# Altium schematic sheet AQCA-Light-Control-WarmWhite-A0.SchDoc
size A4
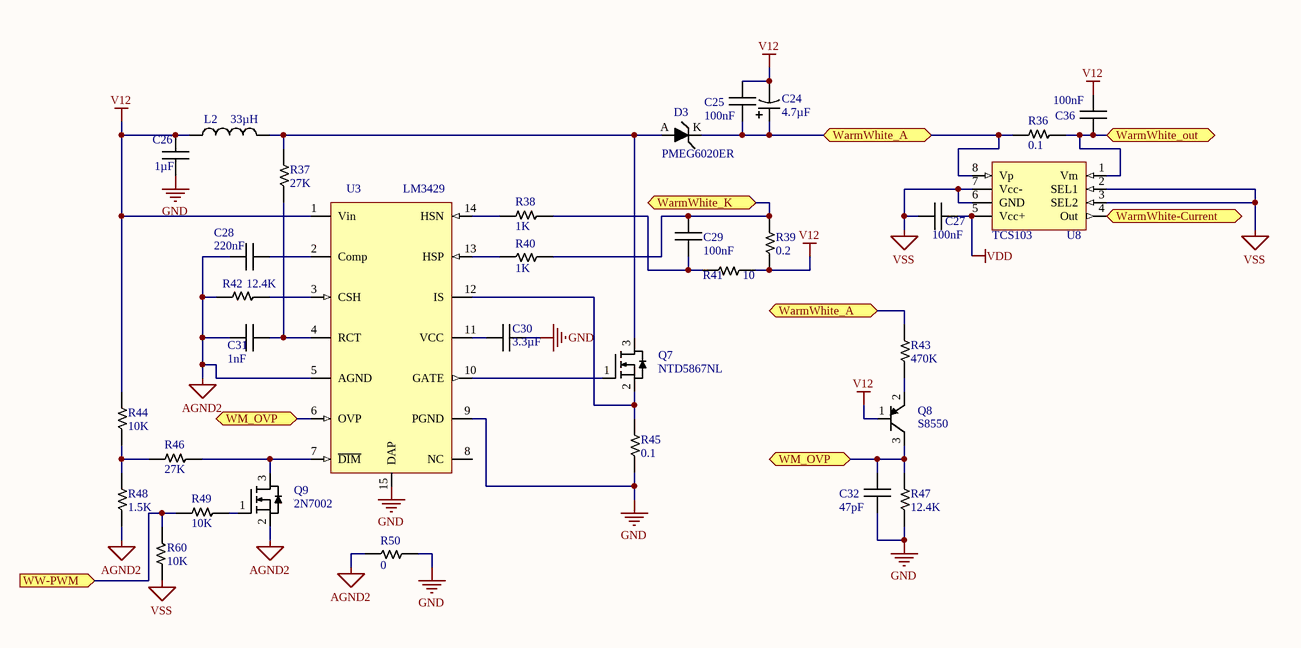
[diagram p0: AQCA-Light-Control-WarmWhite-A0.SchDoc]

## Parts
C24  4.7µF  [CAPPR2-5x11]
C25  100nF  [CAPC2012N]
C26  1µF  [CAPC1608N]
C27  100nF  [CAPC1608N]
C28  220nF  [CAPC1608N]
C29  100nF  [CAPC1608N]
C30  3.3µF  [CAPC1608N]
C31  1nF  [CAPC1608N]
C32  47pF  [CAPC1608N]
C36  100nF  [CAPC2012N]
D3  PMEG6020ER  [SOD123]
L2  33µH  [Inductor AIUR5-6]
Q7  NTD5867NL  [DPAK 369AA]
Q8  S8550  [SOT23_N]
Q9  2N7002  [SOT23-3N]
R36  0.1  [RESC2012N]
R37  27K  [RESC1608N]
R38  1K  [RESC1608N]
R39  0.2  [RESC6332N]
R40  1K  [RESC1608N]
R41  10  [RESC1608N]
R42  12.4K  [RESC1608N]
R43  470K  [RESC1608N]
R44  10K  [RESC1608N]
R45  0.1  [RESC6332N]
R46  27K  [RESC1608N]
R47  12.4K  [RESC1608N]
R48  1.5K  [RESC1608N]
R49  10K  [RESC1608N]
R50  0  [RESC1608N]
R60  10K  [RESC1608N]
U3  LM3429  [TSOP65P640_HS-14N]
U8  TCS103  [TSSOP8N_N]

## Ports
WarmWhite-Current, WarmWhite_A, WarmWhite_K, WarmWhite_out, WM_OVP, WW-PWM (in)

## Nets
AGND2: C28.1 C31.1 Q9.2(S) R42.2 R48.1 R50.1 U3.5(AGND)
GND: C26.1 C30.1 C32.1 R45.1 R47.1 R50.2 U3.9(PGND) U3.15(DAP)
V12: C24.2 C25.2 C26.2 C36.2 L2.1 Q8.1(B) R39.1 R41.2 R44.2 U3.1(Vin)
VDD: C27.1 U8.5(Vcc+)
VSS: C27.2 R60.2 U8.2(SEL1) U8.3(SEL2) U8.6(GND) U8.7(Vcc-)
WarmWhite-Current: U8.4(Out) ; port WarmWhite-Current
WarmWhite_A: C24.1 C25.1 D3.K(Kathode) R36.2 R43.2 U8.8(Vp) ; port WarmWhite_A
WarmWhite_K: C29.2 R39.2 R40.2 ; port WarmWhite_K
WarmWhite_out: C36.1 R36.1 U8.1(Vm) ; port WarmWhite_out
WM_OVP: C32.2 Q8.3(C) R47.2 U3.6(OVP) ; port WM_OVP
WW-PWM: R49.2 R60.1 ; port WW-PWM
NetC28_2: C28.2 U3.2(Comp)
NetC29_1: C29.1 R38.1 R41.1
NetC30_2: C30.2 U3.11(VCC)
NetC31_2: C31.2 R37.1 U3.4(RCT)
NetD3_A: D3.A(Anode) L2.2 Q7.3(D) R37.2
NetQ7_1: Q7.1(G) U3.10(GATE)
NetQ7_2: Q7.2(S) R45.2 U3.12(IS)
NetQ8_2: Q8.2(E) R43.1
NetQ9_1: Q9.1(G) R49.1
NetQ9_3: Q9.3(D) R46.1 U3.7(~{DIM})
NetR38_2: R38.2 U3.14(HSN)
NetR40_1: R40.1 U3.13(HSP)
NetR42_1: R42.1 U3.3(CSH)
NetR44_1: R44.1 R46.2 R48.2

Not connected (* = marked no-connect by the designer): U3 8(NC)

## Library data of the parts
C24 = Capacitor Polarised: Voltage: 100V; Value: 4.7µF
C25 C32 C36 = Capacitor: Voltage: 100V
  C25 C36: Value: 100nF
  C32: Value: 47pF
C26 C28 = Capacitor: Voltage: 25V
  C26: Value: 1µF
  C28: Value: 220nF
C27 C30 = Capacitor: Voltage: 16V
  C27: Value: 100nF
  C30: Value: 3.3µF
C29 C31 = Capacitor: Voltage: 50V
  C29: Value: 100nF
  C31: Value: 1nF
D3 = Schottky Diode: pin to pad: A>1 K>2; Vf: 0.46V; Vr: 60V; If: 2A; Model: PMEG6020ER
L2 = Inductor: DC Current: 5.2A; Value: 33µH
Q7 = MOSFET N-Ch: pin to pad: 2>3 3>4; Vdss: 60V; Id: 20A; RdsON: 0.05; Model: NTD5867NL
Q8 = PNP: pin to pad: 1>3 3>1; Model: S8550
Q9 = MOSFET N-Ch: Vdss: 60V; Id: 115mA; RdsON: 7.5; Model: 2N7002
R36-R50 R60 = Resistor
  R36 R45: Value: 0.1
  R37 R46: Value: 27K
  R38 R40: Value: 1K
  R39: Value: 0.2
  R41: Value: 10
  R42 R47: Value: 12.4K
  R43: Value: 470K
  R44 R49 R60: Value: 10K
  R48: Value: 1.5K
  R50: Value: 0